# Altium schematic sheet uC.SchDoc
size Letter
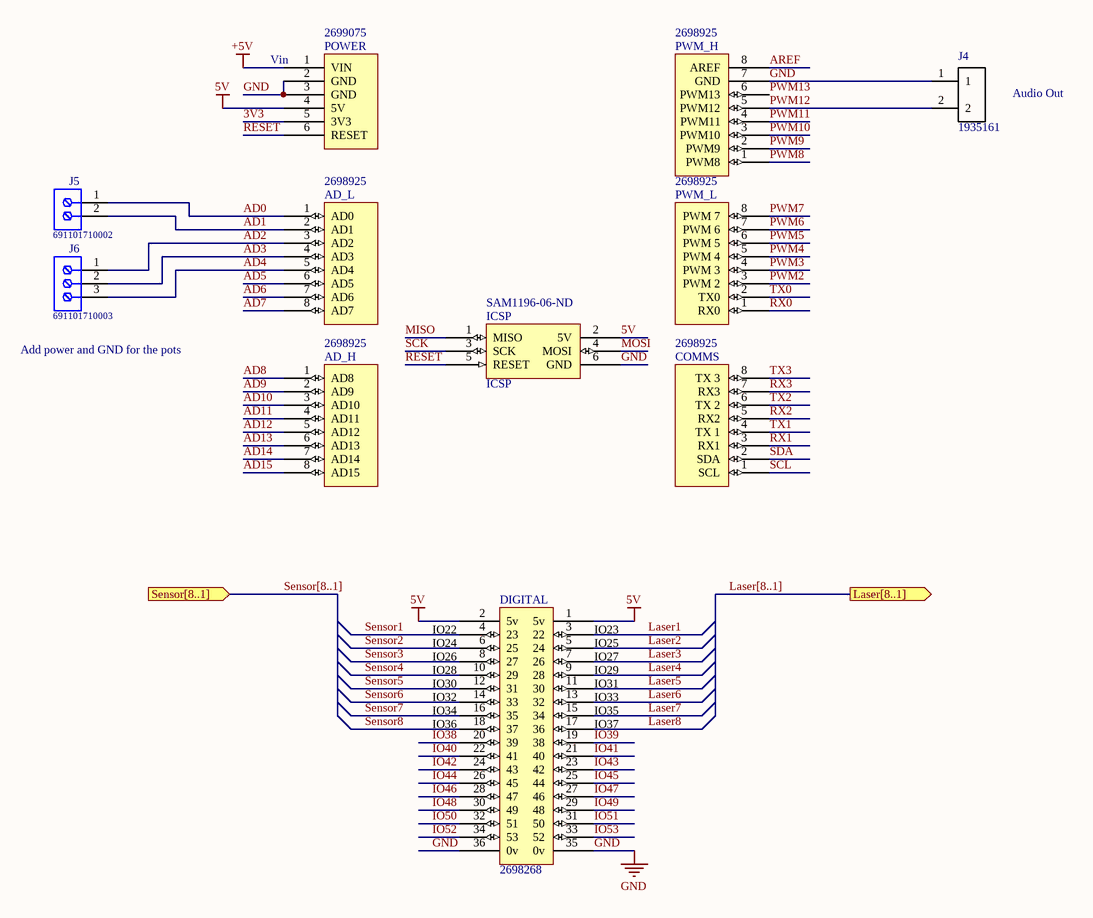
[diagram p0: uC.SchDoc]

## Parts
AD_H  Supplier Part Number 4: 2698925  [Header 8x1 8.5mm]  (hidden comment: AD_H)
AD_L  Supplier Part Number 5: 2698925  [Header 8x1 8.5mm]  (hidden comment: AD_L)
COMMS  Supplier Part Number 4: 2698925  [Header 8x1 8.5mm]  (hidden comment: Communication)
DIGITAL  Supplier Part Number 5: 2698268  [HEADER 36X 8MM]  (hidden comment: IO_36)
ICSP  ICSP  Supplier Part Number 5: SAM1196-06-ND  [ICSP]
J4  1935161  [PHOENIX_1935161]
J5  691101710002  [691101710002]
J6  691101710003  [691101710003]
POWER  Supplier Part Number 2: 2699075  [Header 6x1 8.5mm]  (hidden comment: POWER)
PWM_H  Supplier Part Number 4: 2698925  [Header 8x1 8.5mm]  (hidden comment: PWM_H)
PWM_L  Supplier Part Number 4: 2698925  [Header 8x1 8.5mm]  (hidden comment: PWM_L)

## Ports
Laser[8..1] (out), Sensor[8..1] (in)

## Nets
5V: DIGITAL.1(5v) DIGITAL.2(5v) ICSP.2(5V) POWER.4(5V)
+5V: POWER.1(VIN)
GND: DIGITAL.35(0v) DIGITAL.36(0v) ICSP.6(GND) J4.1 POWER.2(GND) POWER.3(GND) PWM_H.7(GND)
3V3: POWER.5(3V3)
AD0: AD_L.1(AD0) J5.1
AD1: AD_L.2(AD1) J5.2
AD2: AD_L.3(AD2) J6.1
AD3: AD_L.4(AD3) J6.2
AD4: AD_L.5(AD4) J6.3
AD5: AD_L.6(AD5)
AD6: AD_L.7(AD6)
AD7: AD_L.8(AD7)
AD8: AD_H.1(AD8)
AD9: AD_H.2(AD9)
AD10: AD_H.3(AD10)
AD11: AD_H.4(AD11)
AD12: AD_H.5(AD12)
AD13: AD_H.6(AD13)
AD14: AD_H.7(AD14)
AD15: AD_H.8(AD15)
AREF: PWM_H.8(AREF)
IO38: DIGITAL.20(39)
IO39: DIGITAL.19(38)
IO40: DIGITAL.22(41)
IO41: DIGITAL.21(40)
IO42: DIGITAL.24(43)
IO43: DIGITAL.23(42)
IO44: DIGITAL.26(45)
IO45: DIGITAL.25(44)
IO46: DIGITAL.28(47)
IO47: DIGITAL.27(46)
IO48: DIGITAL.30(49)
IO49: DIGITAL.29(48)
IO50: DIGITAL.32(51)
IO51: DIGITAL.31(50)
IO52: DIGITAL.34(53)
IO53: DIGITAL.33(52)
Laser1: DIGITAL.3(22)
Laser2: DIGITAL.5(24)
Laser3: DIGITAL.7(26)
Laser4: DIGITAL.9(28)
Laser5: DIGITAL.11(30)
Laser6: DIGITAL.13(32)
Laser7: DIGITAL.15(34)
Laser8: DIGITAL.17(36)
MISO: ICSP.1(MISO)
MOSI: ICSP.4(MOSI)
PWM2: PWM_L.3(PWM_2)
PWM3: PWM_L.4(PWM_3)
PWM4: PWM_L.5(PWM_4)
PWM5: PWM_L.6(PWM_5)
PWM6: PWM_L.7(PWM_6)
PWM7: PWM_L.8(PWM_7)
PWM8: PWM_H.1(PWM8)
PWM9: PWM_H.2(PWM9)
PWM10: PWM_H.3(PWM10)
PWM11: PWM_H.4(PWM11)
PWM12: J4.2 PWM_H.5(PWM12)
PWM13: PWM_H.6(PWM13)
RESET: ICSP.5(RESET) POWER.6(RESET)
RX0: PWM_L.1(RX0)
RX1: COMMS.3(RX1)
RX2: COMMS.5(RX2)
RX3: COMMS.7(RX3)
SCK: ICSP.3(SCK)
SCL: COMMS.1(SCL)
SDA: COMMS.2(SDA)
Sensor1: DIGITAL.4(23)
Sensor2: DIGITAL.6(25)
Sensor3: DIGITAL.8(27)
Sensor4: DIGITAL.10(29)
Sensor5: DIGITAL.12(31)
Sensor6: DIGITAL.14(33)
Sensor7: DIGITAL.16(35)
Sensor8: DIGITAL.18(37)
TX0: PWM_L.2(TX0)
TX1: COMMS.4(TX_1)
TX2: COMMS.6(TX_2)
TX3: COMMS.8(TX_3)

## Buses and harness runs
bus Laser[8..1] = port Laser[8..1]
bus Sensor[8..1] = port Sensor[8..1]

## Notes on the sheet
- (near POWER) Vin
- Audio Out
- (near J6) Add power and GND for the pots
- (near DIGITAL) IO22
  IO24
  IO26
  IO28
  IO30
  IO32
  IO34
  IO36
- (near DIGITAL) IO23
  IO25
  IO27
  IO29
  IO31
  IO33
  IO35
  IO37
- Title
- Size:
- Date:
- Letter
- Number:
- Time:
- Revision:
- Sheet
- of
- File:

## Library data of the parts
J4 = 1935161: Conn Terminal Blocks 2 POS 5mm Solder ST Thru-Hole 16A; MF: Phoenix Contact; Digi-Key_Part_Number: 277-1667-ND; Package: None; SnapEDA_Link: https://www.snapeda.com/parts/1935161/Phoenix%20Contact/view-part/?ref=snap; MP: 1935161; Digi-Key_Purchase_URL: https://www.digikey.com/product-detail/en/phoenix-contact/1935161/277-1667-ND/568614?utm_source=snapeda&utm_medium=aggregator&utm_campaign=symbol; Value: *
J5 = 691101710002: Series 101 - 5.00 mm Horizontal Entry Modular with Pressure Clamp WR-TBL, 2 pin; Pin Number: 2; Pitch: 5.00 mm; ComponentLink1Description: Manufacturer; ComponentLink1URL: http://www.we-online.de; ComponentLink2Description: Datasheet; ComponentLink2URL: http://katalog.we-online.de/em/datasheet/6911017100xx.pdf; Part Number: 691101710002; Published Date: May 2018; Publisher: Wurth Elektronik; Operating Temperature: -40 to 105 degC; Mounting Technology: THT; Packaging: Box
J6 = 691101710003: Series 101 - 5.00 mm Horizontal Entry Modular with Pressure Clamp WR-TBL, 3 pin; Pin Number: 3; Pitch: 5.00 mm; ComponentLink1Description: Manufacturer; ComponentLink1URL: http://www.we-online.de; ComponentLink2Description: Datasheet; ComponentLink2URL: http://katalog.we-online.de/em/datasheet/6911017100xx.pdf; Part Number: 691101710003; Published Date: May 2018; Publisher: Wurth Elektronik; Operating Temperature: -40 to 105 degC; Mounting Technology: THT; Packaging: Box
AD_H = AD_H: Supplier 1: Arrow; Supplier Part Number 1: 2698940; Supplier 2: Arrow; Supplier Part Number 2: 2698939; Supplier 3: Digi-Key; Supplier Part Number 3: SAM1198-08-ND; Supplier 4: Arrow
AD_L = AD_L: Supplier 1: Digi-Key; Supplier Part Number 1: SAM1198-08-ND; Supplier 2: Arrow; Supplier Part Number 2: 2698939; Supplier 3: Arrow; Supplier Part Number 3: 2698940; Supplier 4: Arrow; Supplier Part Number 4: 43085273; Supplier 5: Arrow
COMMS = Communication: Supplier 1: Digi-Key; Supplier Part Number 1: SAM1198-08-ND; Supplier 2: Arrow; Supplier Part Number 2: 2698940; Supplier 3: Arrow; Supplier Part Number 3: 2698939; Supplier 4: Arrow
DIGITAL = IO_36: Supplier 1: Digi-Key; Supplier Part Number 1: SAM1196-18-ND; Supplier 2: Arrow; Supplier Part Number 2: 48117090; Supplier 3: Arrow; Supplier Part Number 3: 46093326; Supplier 4: Arrow; Supplier Part Number 4: 2698278; Supplier 5: Arrow
ICSP = ICSP: Supplier 1: Digi-Key; Supplier Part Number 1: SAM1185-06-ND; Supplier 2: Arrow; Supplier Part Number 2: 2699117; Supplier 3: Arrow; Supplier Part Number 3: 43862781; Supplier 4: Arrow; Supplier Part Number 4: 2699091; Supplier 5: Digi-Key
POWER = POWER: Supplier 1: Arrow; Supplier Part Number 1: 52553843; Supplier 2: Arrow; Supplier 3: Digi-Key; Supplier Part Number 3: SAM1198-06-ND; Supplier 4: Arrow; Supplier Part Number 4: 2699089; Supplier 5: Arrow; Supplier Part Number 5: 2699088
PWM_H = PWM_H: Supplier 1: Digi-Key; Supplier Part Number 1: SAM1198-08-ND; Supplier 2: Arrow; Supplier Part Number 2: 2698940; Supplier 3: Arrow; Supplier Part Number 3: 2698939; Supplier 4: Arrow
PWM_L = PWM_L: Supplier 1: Arrow; Supplier Part Number 1: 2698940; Supplier 2: Arrow; Supplier Part Number 2: 2698939; Supplier 3: Digi-Key; Supplier Part Number 3: SAM1198-08-ND; Supplier 4: Arrow